# Altium schematic sheet 09-RTL8111H-2.schdoc
size A2
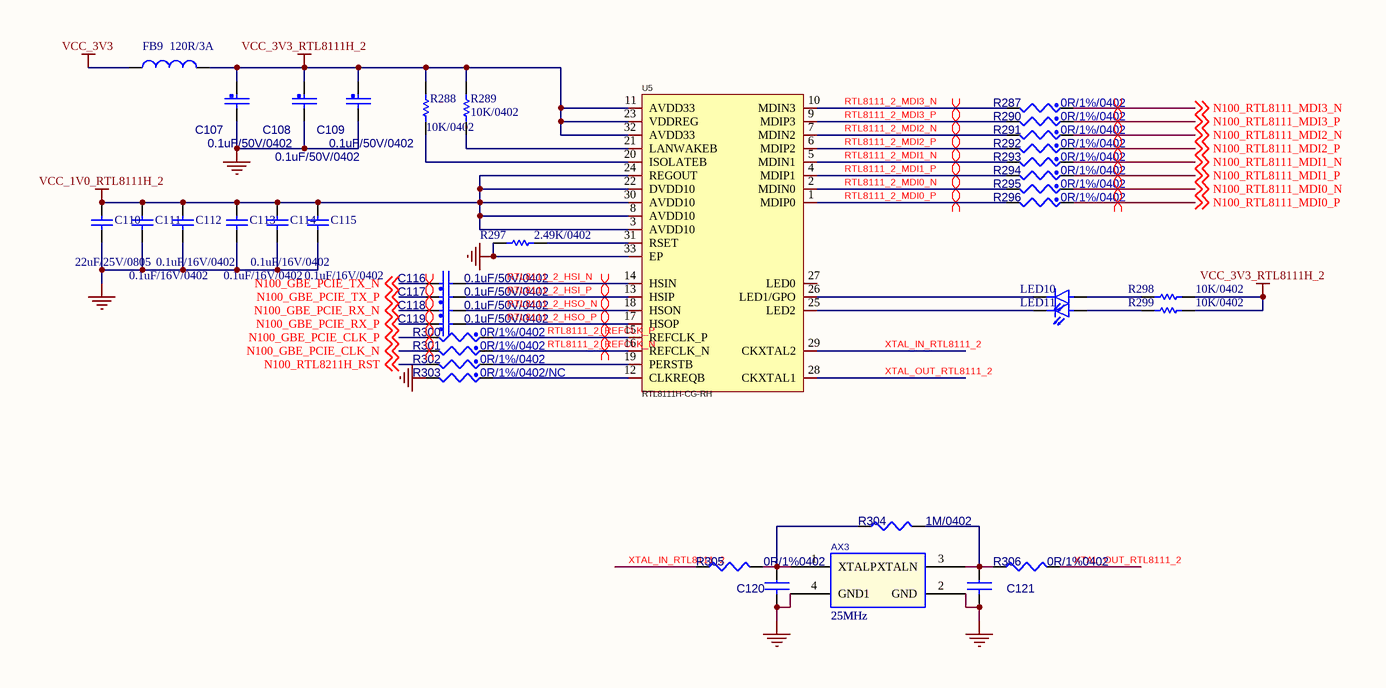
[diagram p0: 09-RTL8111H-2.schdoc]

## Parts
AX3  25MHz  [2016]
C107  value 0.1uF/50V/0402  [C0402]  (hidden comment: CAP_NP)
C108  value 0.1uF/50V/0402  [C0402]  (hidden comment: CAP_NP)
C109  value 0.1uF/50V/0402  [C0402]  (hidden comment: CAP_NP)
C110  22uF/25V/0805  [C0805]
C111  0.1uF/16V/0402  [C0402]
C112  0.1uF/16V/0402  [C0402]
C113  0.1uF/16V/0402  [C0402]
C114  0.1uF/16V/0402  [C0402]
C115  0.1uF/16V/0402  [C0402]
C116  value 0.1uF/50V/0402  [C0402]  (hidden comment: CAP_NP)
C117  value 0.1uF/50V/0402  [C0402]  (hidden comment: CAP_NP)
C118  value 0.1uF/50V/0402  [C0402]  (hidden comment: CAP_NP)
C119  value 0.1uF/50V/0402  [C0402]  (hidden comment: CAP_NP)
C120  CAP NP_Dup3  [C0402]  (value not drawn)
C121  CAP NP_Dup3  [C0402]  (value not drawn)
FB9  120R/3A  [L0603]
LED10  LED_GREEN  [LED0603]  (value not drawn)
LED11  LED_GREEN  [LED0603]  (value not drawn)
R287  value 0R/1%/0402  [R0402]  (hidden comment: RES_Dup2)
R288  10K/0402  [R0402]
R289  10K/0402  [R0402]
R290  value 0R/1%/0402  [R0402]  (hidden comment: RES_Dup2)
R291  value 0R/1%/0402  [R0402]  (hidden comment: RES_Dup2)
R292  value 0R/1%/0402  [R0402]  (hidden comment: RES_Dup2)
R293  value 0R/1%/0402  [R0402]  (hidden comment: RES_Dup2)
R294  value 0R/1%/0402  [R0402]  (hidden comment: RES_Dup2)
R295  value 0R/1%/0402  [R0402]  (hidden comment: RES_Dup2)
R296  value 0R/1%/0402  [R0402]  (hidden comment: RES_Dup2)
R297  2.49K/0402  [R0402]
R298  10K/0402  [R0402]
R299  10K/0402  [R0402]
R300  value 0R/1%/0402  [R0402]  (hidden comment: RES_Dup2)
R301  value 0R/1%/0402  [R0402]  (hidden comment: RES_Dup2)
R302  value 0R/1%/0402  [R0402]  (hidden comment: RES_Dup2)
R303  value 0R/1%/0402/NC  [R0402]  (hidden comment: RES_Dup2)
R304  value 1M/0402  [R0402]  (hidden comment: R_Dup3)
R305  value 0R/1%0402  [R0402]  (hidden comment: R_Dup3)
R306  value 0R/1%0402  [R0402]  (hidden comment: R_Dup3)
U5  RTL8111H-CG-RH  [RTL8111H-CG-RH]

## Nets
GND: AX3.2(GND) AX3.4(GND1) C107.2 C108.2 C109.2 C110.1 C111.1 C112.1 C113.1 C114.1 C115.1 C120.2 C121.2 R297.1 R303.2 U5.33(EP)
VCC_1V0_RTL8111H_2: C110.2 C111.2 C112.2 C113.2 C114.2 C115.2 U5.3(AVDD10) U5.8(AVDD10) U5.22(DVDD10) U5.24(REGOUT) U5.30(AVDD10)
VCC_3V3: FB9.1
VCC_3V3_RTL8111H_2: C107.1 C108.1 C109.1 FB9.2 R288.1 R289.1 R298.1 R299.1 U5.11(AVDD33) U5.23(VDDREG) U5.32(AVDD33)
N100_GBE_PCIE_CLK_N: R301.2 ; off-sheet N100_GBE_PCIE_CLK_N
N100_GBE_PCIE_CLK_P: R300.2 ; off-sheet N100_GBE_PCIE_CLK_P
N100_GBE_PCIE_RX_N: C118.1 ; off-sheet N100_GBE_PCIE_RX_N
N100_GBE_PCIE_RX_P: C119.1 ; off-sheet N100_GBE_PCIE_RX_P
N100_GBE_PCIE_TX_N: C116.1 ; off-sheet N100_GBE_PCIE_TX_N
N100_GBE_PCIE_TX_P: C117.1 ; off-sheet N100_GBE_PCIE_TX_P
N100_RTL8111_MDI0_N: R295.1 ; off-sheet N100_RTL8111_MDI0_N
N100_RTL8111_MDI0_P: R296.1 ; off-sheet N100_RTL8111_MDI0_P
N100_RTL8111_MDI1_N: R293.1 ; off-sheet N100_RTL8111_MDI1_N
N100_RTL8111_MDI1_P: R294.1 ; off-sheet N100_RTL8111_MDI1_P
N100_RTL8111_MDI2_N: R291.1 ; off-sheet N100_RTL8111_MDI2_N
N100_RTL8111_MDI2_P: R292.1 ; off-sheet N100_RTL8111_MDI2_P
N100_RTL8111_MDI3_N: R287.1 ; off-sheet N100_RTL8111_MDI3_N
N100_RTL8111_MDI3_P: R290.1 ; off-sheet N100_RTL8111_MDI3_P
N100_RTL8211H_RST: R302.2 ; off-sheet N100_RTL8211H_RST
RTL8111_2_HSI_N: C116.2 U5.14(HSIN)
RTL8111_2_HSI_P: C117.2 U5.13(HSIP)
RTL8111_2_HSO_N: C118.2 U5.18(HSON)
RTL8111_2_HSO_P: C119.2 U5.17(HSOP)
RTL8111_2_MDI0_N: R295.2 U5.2(MDIN0)
RTL8111_2_MDI0_P: R296.2 U5.1(MDIP0)
RTL8111_2_MDI1_N: R293.2 U5.5(MDIN1)
RTL8111_2_MDI1_P: R294.2 U5.4(MDIP1)
RTL8111_2_MDI2_N: R291.2 U5.7(MDIN2)
RTL8111_2_MDI2_P: R292.2 U5.6(MDIP2)
RTL8111_2_MDI3_N: R287.2 U5.10(MDIN3)
RTL8111_2_MDI3_P: R290.2 U5.9(MDIP3)
RTL8111_2_REFCLK_N: R301.1 U5.16(REFCLK_N)
RTL8111_2_REFCLK_P: R300.1 U5.15(REFCLK_P)
XTAL_IN_RTL8111_2: R305.1 U5.29(CKXTAL2)
XTAL_OUT_RTL8111_2: R306.2 U5.28(CKXTAL1)
NetAX3_1: AX3.1(XTALP) C120.1 R304.1 R305.2
NetAX3_3: AX3.3(XTALN) C121.1 R304.2 R306.1
NetLED10_1: LED10.1 R298.2
NetLED10_2: LED10.2 U5.26(LED1/GPO)
NetLED11_1: LED11.1 R299.2
NetLED11_2: LED11.2 U5.25(LED2)
NetR288_2: R288.2 U5.20(ISOLATEB)
NetR289_2: R289.2 U5.21(LANWAKEB)
NetR297_2: R297.2 U5.31(RSET)
NetR302_1: R302.1 U5.19(PERSTB)
NetR303_1: R303.1 U5.12(CLKREQB)

Not connected (* = marked no-connect by the designer): U5 27(LED0)

## Layout directives
differential pair: N100_GBE_PCIE_CLK_N, N100_GBE_PCIE_CLK_P, N100_GBE_PCIE_RX_N, N100_GBE_PCIE_RX_P, N100_GBE_PCIE_TX_N, N100_GBE_PCIE_TX_P, N100_RTL8111_MDI0_N, N100_RTL8111_MDI0_P, N100_RTL8111_MDI1_N, N100_RTL8111_MDI1_P, N100_RTL8111_MDI2_N, N100_RTL8111_MDI2_P, N100_RTL8111_MDI3_N, N100_RTL8111_MDI3_P, RTL8111_2_HSI_N, RTL8111_2_HSI_P, RTL8111_2_HSO_N, RTL8111_2_HSO_P, RTL8111_2_MDI0_N, RTL8111_2_MDI0_P, RTL8111_2_MDI1_N, RTL8111_2_MDI1_P, RTL8111_2_MDI2_N, RTL8111_2_MDI2_P, RTL8111_2_MDI3_N, RTL8111_2_MDI3_P, RTL8111_2_REFCLK_N, RTL8111_2_REFCLK_P

## Library data of the parts
AX3 = XTAL_0: Part Reference: AX3; PCB Footprint: CRY5032; Value: 25MHz
C107-C109 C116-C119 = CAP_NP: GCM155R71H104KE02/MURATA; Part Reference: C15; CLASS: DISCRETE; FPLIST: CC0402_25,CC0402_HD,CC0402_CC; CAD_APPROVED: Yes; MFG_PN01: 0402YC104KAT2A; MFG_NAME01: AVX; Tolerance: 10%; AGILE_PN: 150-75182; VOLTAGE: 16V; HEIGHT: 0.635MM; ROHS: Yes; TOL: 10%; PCB Footprint: C0402
C110-C115 = CAP: Capacitor; Value: 100pF; Published: 8-Jun-2000; Revision: July-2002: Re-released for DXP Platform.; Publisher: Altium Limited
C120 = CAP NP_Dup3: Part Reference: C71; Value: 20pF/50V X7R; PCB Footprint: C0402
C121 = CAP NP_Dup3: Part Reference: C72; Value: 20pF/50V X7R; PCB Footprint: C0402
FB9 = Inductor: BLM18KG121TN1D; Code_IEC: 1005; Value: 10mH; Published: 8-Jun-2000; LatestRevisionDate: 29-May-2009; LatestRevisionNote: IPC-7351 Footprint Added.; PackageReference: 0402-A; Publisher: Altium Limited; PackageDescription: Chip Inductor; Code_JEITA: 0402
LED10 LED11 = LED
R287 R300 = RES_Dup2: AC0402FR-070RL/YAGEO; Part Reference: R97; CLASS: DISCRETE; SIGNAL_MODEL: DEFAULT_RESISTOR_33.000000OHM_2_1; FPLIST: RC0603_OV; CAD_APPROVED: Yes; MFG_PN01: CR-02FL6---33R; MFG_NAME01: YAGEO; Tolerance: 1%; AGILE_PN: 470-75790; TOL: 5%; ROHS: Yes; HEIGHT: 0.4MM; PCB Footprint: R0402
R288 R289 R297 = Res Semi: Semiconductor Resistor; Value: 240R; Published: 8-Jun-2000; LatestRevisionDate: 17-Jul-2002; LatestRevisionNote: Re-released for DXP Platform.; PackageReference: AXIAL-0.5; Publisher: Altium Limited; PackageDescription: Axial Device, Thru-Hole; 2 Leads; 0.5 in Pin Spacing
R290 R301-R303 = RES_Dup2: AC0402FR-070RL/YAGEO; Part Reference: R98; CLASS: DISCRETE; TOL: 5%; AGILE_PN: 470-75790; Tolerance: 1%; MFG_NAME01: YAGEO; MFG_PN01: CR-02FL6---33R; CAD_APPROVED: Yes; FPLIST: RC0603_OV; SIGNAL_MODEL: DEFAULT_RESISTOR_33.000000OHM_2_1; HEIGHT: 0.4MM; ROHS: Yes; PCB Footprint: R0402
R291 = RES_Dup2: AC0402FR-070RL/YAGEO; Part Reference: R99; CLASS: DISCRETE; TOL: 5%; AGILE_PN: 470-75790; Tolerance: 1%; MFG_NAME01: YAGEO; MFG_PN01: CR-02FL6---33R; CAD_APPROVED: Yes; FPLIST: RC0603_OV; SIGNAL_MODEL: DEFAULT_RESISTOR_33.000000OHM_2_1; HEIGHT: 0.4MM; ROHS: Yes; PCB Footprint: R0402
R292 = RES_Dup2: AC0402FR-070RL/YAGEO; Part Reference: R101; CLASS: DISCRETE; TOL: 5%; AGILE_PN: 470-75790; Tolerance: 1%; MFG_NAME01: YAGEO; MFG_PN01: CR-02FL6---33R; CAD_APPROVED: Yes; FPLIST: RC0603_OV; SIGNAL_MODEL: DEFAULT_RESISTOR_33.000000OHM_2_1; HEIGHT: 0.4MM; ROHS: Yes; PCB Footprint: R0402
R293 = RES_Dup2: AC0402FR-070RL/YAGEO; Part Reference: R102; CLASS: DISCRETE; TOL: 5%; AGILE_PN: 470-75790; Tolerance: 1%; MFG_NAME01: YAGEO; MFG_PN01: CR-02FL6---33R; CAD_APPROVED: Yes; FPLIST: RC0603_OV; SIGNAL_MODEL: DEFAULT_RESISTOR_33.000000OHM_2_1; HEIGHT: 0.4MM; ROHS: Yes; PCB Footprint: R0402
R294 = RES_Dup2: AC0402FR-070RL/YAGEO; Part Reference: R103; CLASS: DISCRETE; TOL: 5%; AGILE_PN: 470-75790; Tolerance: 1%; MFG_NAME01: YAGEO; MFG_PN01: CR-02FL6---33R; CAD_APPROVED: Yes; FPLIST: RC0603_OV; SIGNAL_MODEL: DEFAULT_RESISTOR_33.000000OHM_2_1; HEIGHT: 0.4MM; ROHS: Yes; PCB Footprint: R0402
R295 = RES_Dup2: AC0402FR-070RL/YAGEO; Part Reference: R104; CLASS: DISCRETE; TOL: 5%; AGILE_PN: 470-75790; Tolerance: 1%; MFG_NAME01: YAGEO; MFG_PN01: CR-02FL6---33R; CAD_APPROVED: Yes; FPLIST: RC0603_OV; SIGNAL_MODEL: DEFAULT_RESISTOR_33.000000OHM_2_1; HEIGHT: 0.4MM; ROHS: Yes; PCB Footprint: R0402
R296 = RES_Dup2: AC0402FR-070RL/YAGEO; Part Reference: R105; CLASS: DISCRETE; TOL: 5%; AGILE_PN: 470-75790; Tolerance: 1%; MFG_NAME01: YAGEO; MFG_PN01: CR-02FL6---33R; CAD_APPROVED: Yes; FPLIST: RC0603_OV; SIGNAL_MODEL: DEFAULT_RESISTOR_33.000000OHM_2_1; HEIGHT: 0.4MM; ROHS: Yes; PCB Footprint: R0402
R298 R299 = Res Semi: Semiconductor Resistor; Value: 1K; Published: 8-Jun-2000; LatestRevisionDate: 17-Jul-2002; LatestRevisionNote: Re-released for DXP Platform.; PackageReference: AXIAL-0.5; Publisher: Altium Limited; PackageDescription: Axial Device, Thru-Hole; 2 Leads; 0.5 in Pin Spacing
R304 R305 = R_Dup3: Part Reference: R130; PCB Footprint: R0402
R306 = R_Dup3: Part Reference: R131; PCB Footprint: R0402
U5 = RTL8111H-CG: Manufacturer: REALTEK(瑞昱); Add into BOM: yes; Symbol: RTL8111H-CG; Device: RTL8111H-CG; LCSC Part Name: RTL8111H-CG; Supplier Part: C2761340; Manufacturer Part: RTL8111H-CG; Supplier Footprint: QFN-32-EP(4x4); JLCPCB Part Class: Extended Part; Datasheet: https://atta.szlcsc.com/upload/public/pdf/source/20210810/FF05C5D46F518898BC2EC053E52D54B5.pdf; Supplier: LCSC; Convert to PCB: yes; Comment_1: RTL8111H-CG